# EAGLE design electric fencehigh voltage generator (EAGLE 6.4)
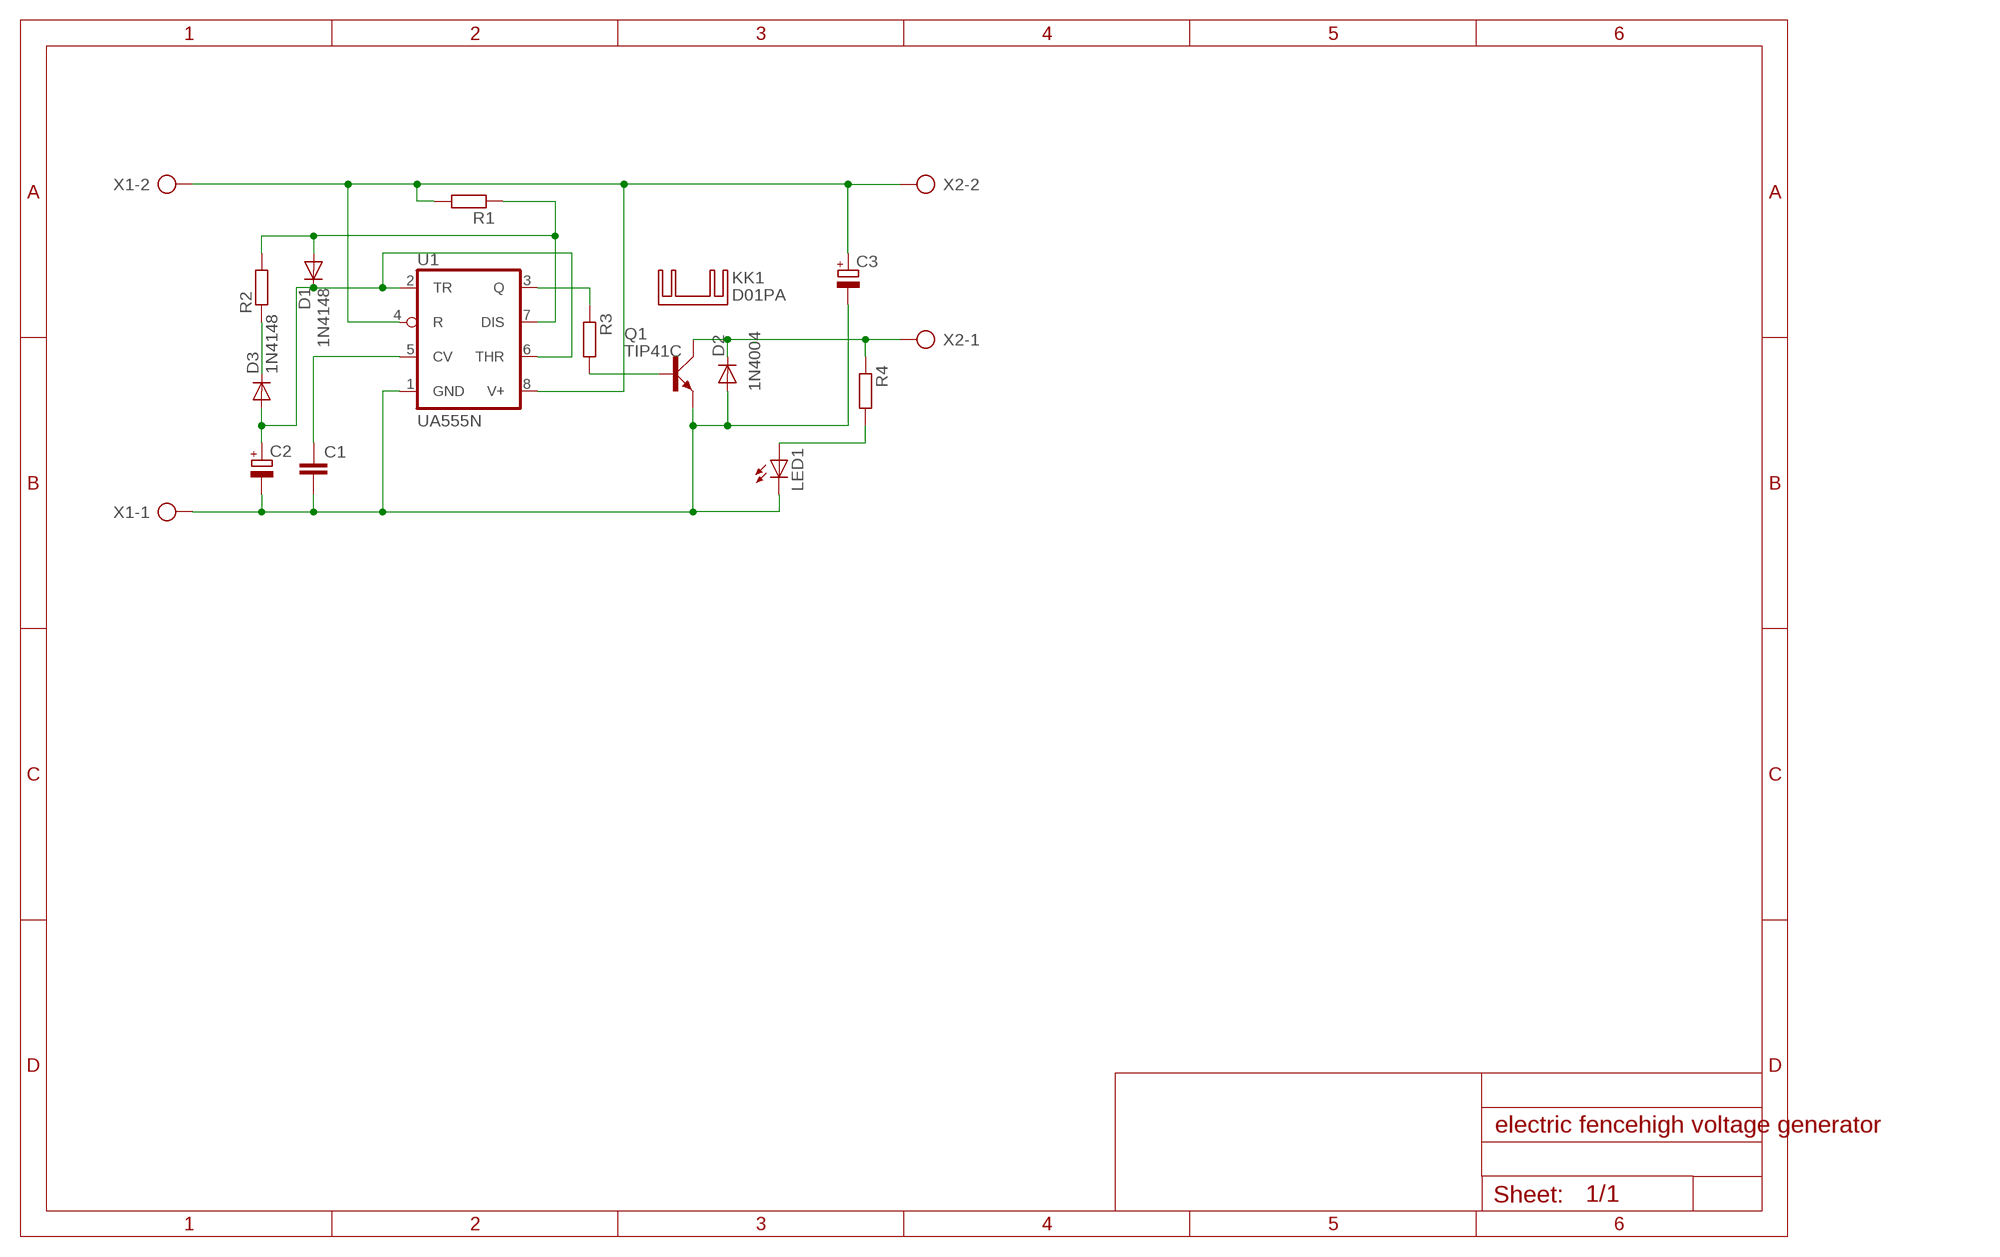
[diagram p0: schematic, sheet 1]

## Parts
C1  C-EU050-030X075  [C050-030X075]
C2  CPOL-EUE2.5-5  [E2,5-5]
C3  CPOL-EUE2.5-5  [E2,5-5]
D1  1N4148  1N4148DO35-7  [DO35-7]
D2  1N4004  [DO41-10]
D3  1N4148  1N4148DO35-7  [DO35-7]
KK1  D01PA  [D01PA]
LED1  LED5MM  [LED5MM]
Q1  TIP41C  [TO220AV]
R1  R-EU_0207/10  [0207/10]
R2  R-EU_0207/10  [0207/10]
R3  R-EU_0207/15  [0207/15]
R4  R-EU_0207/10  [0207/10]
U1  UA555N  [DIL08]
X1  AK300/2  [AK300/2]
X2  AK300/2  [AK300/2]

## Nets
N$1: C3.+ R1.2 U1.4(R) U1.8(V+) X1.2 X2.2
N$2: R3.1 U1.3(Q)
N$3: Q1.B R3.2
N$4: D2.C Q1.C R4.1 X2.1
N$5: C2.+ D1.C D3.A U1.2(TR) U1.6(THR)
N$6: D1.A R1.1 R2.2 U1.7(DIS)
N$7: D3.C R2.1
N$8: LED1.A R4.2
N$9: C1.2 C2.- C3.- D2.A LED1.K(C) Q1.E U1.1(GND) X1.1
N$10: C1.1 U1.5(CV)

## Library data of the parts
C1 = rcl:C-EU: CAPACITOR, European symbol
C2 C3 = rcl:CPOL-EU: POLARIZED CAPACITOR, European symbol
D1 D3 = diode:1N4148: DIODE high speed (Philips)
D2 = diode:1N4004: DIODE general purpose rectifier, 1 A
KK1 = heatsink:D01PA: HEATSINK distributor Schukat
LED1 = led:LED: LED OSRAM: - CHIPLED LG R971, LG N971, LY N971, LG Q971, LY Q971, LO R971, LY R971 LH N974, LH R974 LS Q976, LO Q976, LY Q976 LO Q996 - Hyper CHIPLED LW Q18S LB Q993, LB Q99A, LB R99A - SideLED LS A670, LO A670, LY A670, LG A670, LP A670 LB A673, LV A673, LT A673, LW A673 LH A674 LY A675 LS A676, LA A676, LO A676, LY A676, LW A676 LS A679, LY A679, LG A679 - Hyper Micro SIDELED® LS Y876, LA Y876, LO Y876, LY Y876 LT Y87S - SmartLED LW L88C, LW L88S LB L89C, LB L89S, LG L890 LS L89K, LO L89K, LY L89K LS L896, LA L896, LO L896, LY L896 - TOPLED LS T670, LO T670, LY T670, LG T670, LP T670 LSG T670, LSP T670, LSY T670, LOP T670, LYG T670 LG T671, LOG T671, LSG T671 LB T673, LV T673, LT T673, LW T673 LH T674 LS T676, LA T676, LO T676, LY T676, LB T676, LH T676, LSB T676, LW T676 LB T67C, LV T67C, LT T67C, LS T67K, LO T67K, LY T67K, LW E67C LS E67B, LA E67B, LO E67B, LY E67B, LB E67C, LV E67C, LT E67C LW T67C LS T679, LY T679, LG T679 LS T770, LO T770, LY T770, LG T770, LP T770 LB T773, LV T773, LT T773, LW T773 LH T774 LS E675, LA E675, LY E675, LS T675 LS T776, LA T776, LO T776, LY T776, LB T776 LHGB T686 LT T68C, LB T68C - Hyper Mini TOPLED® LB M676 - Mini TOPLED Santana® LG M470 LS M47K, LO M47K, LY M47K Source: http://www.osram.convergy.de LUXEON: - LUMILED® LXK2-PW12-R00, LXK2-PW12-S00, LXK2-PW14-U00, LXK2-PW14-V00 LXK2-PM12-R00, LXK2-PM12-S00, LXK2-PM14-U00 LXK2-PE12-Q00, LXK2-PE12-R00, LXK2-PE12-S00, LXK2-PE14-T00, LXK2-PE14-U00 LXK2-PB12-K00, LXK2-PB12-L00, LXK2-PB12-M00, LXK2-PB14-N00, LXK2-PB14-P00, LXK2-PB14-Q00 LXK2-PR12-L00, LXK2-PR12-M00, LXK2-PR14-Q00, LXK2-PR14-R00 LXK2-PD12-Q00, LXK2-PD12-R00, LXK2-PD12-S00 LXK2-PH12-R00, LXK2-PH12-S00 LXK2-PL12-P00, LXK2-PL12-Q00, LXK2-PL12-R00 Source: www.luxeon.com KINGBRIGHT: KA-3528ASYC Source: www.kingbright.com
Q1 = transistor-power:TIP41C: NPN TRANSISTOR
R1-R4 = rcl:R-EU_: RESISTOR, European symbol
U1 = linear:*555: TIMER
X1 X2 = con-ptr500:AK300/2: CONNECTOR; OC_FARNELL: unknown; OC_NEWARK: unknown

## Board
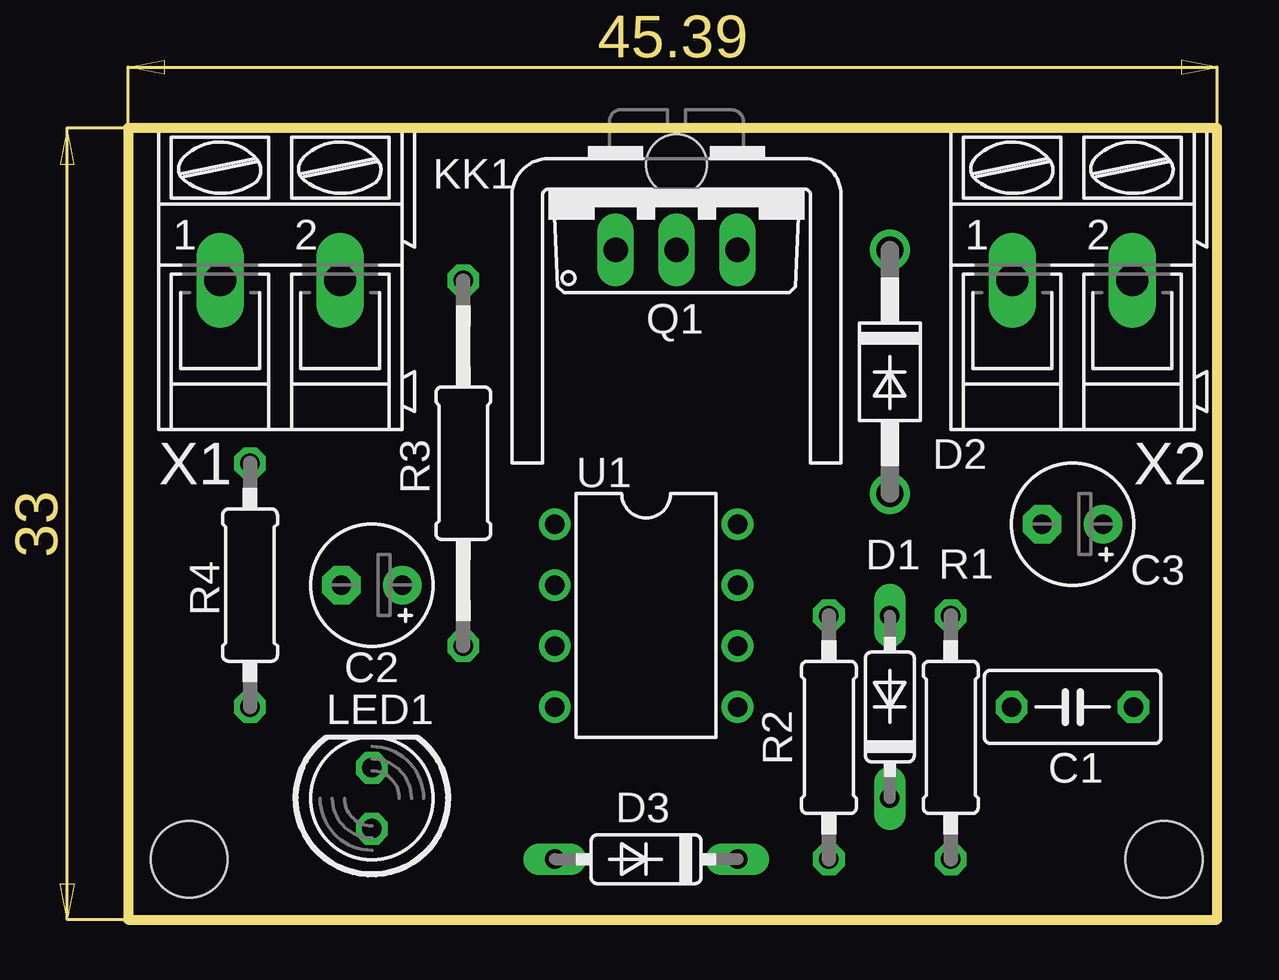
[diagram p1: board, top side]
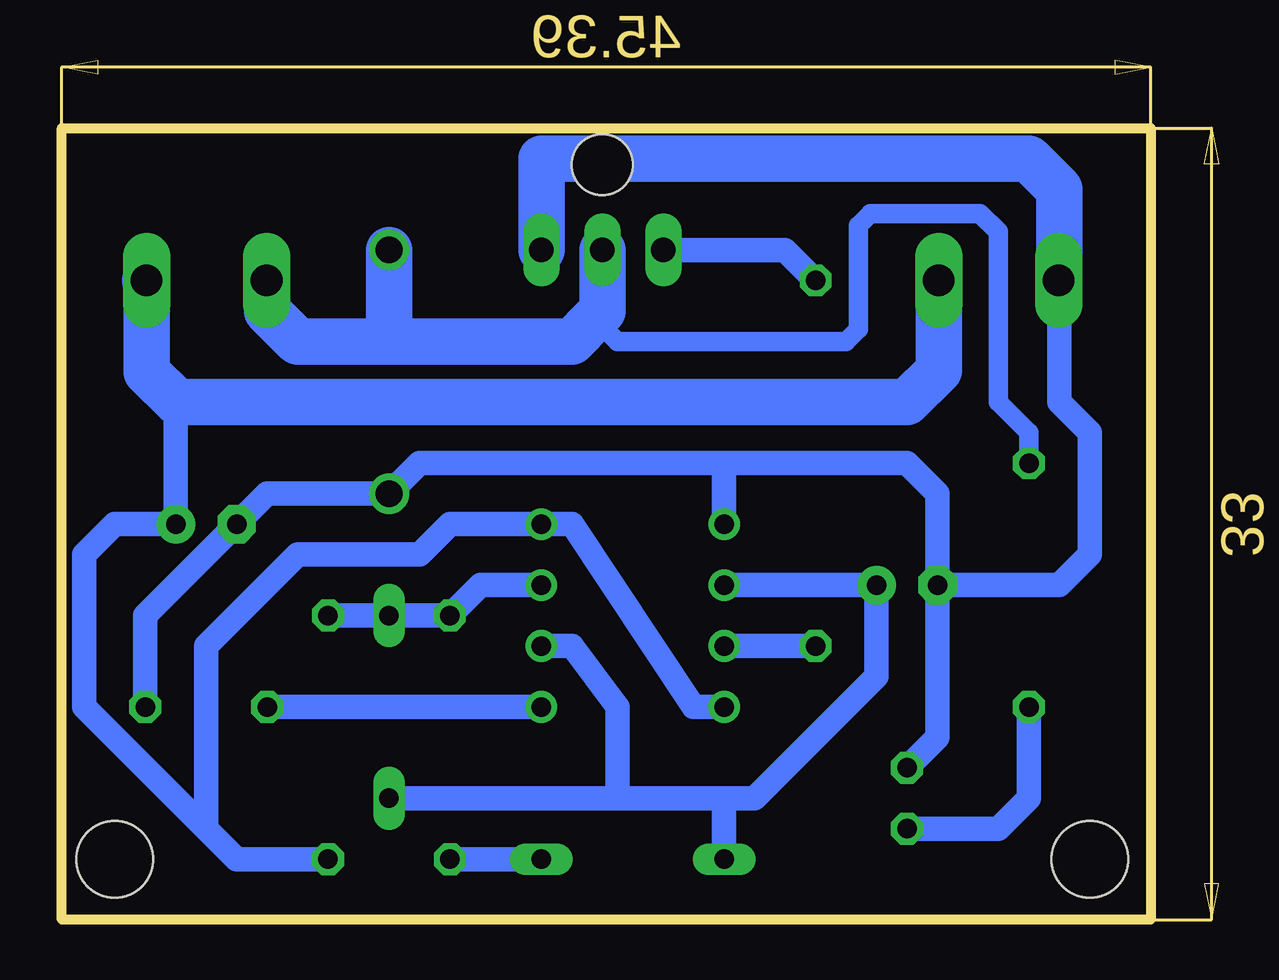
[diagram p2: board, bottom side, seen from below]

Size 45.39 x 33 mm. Coordinates in mm from the lower left corner, seen from the top.
Outline: 0,33 0,0 45.39,0 45.39,33 0,33
Copper layers (1*16): Top 0.035mm / dielectric 1.5mm / Bottom 0.035mm
Design rules "default": minimum track width 10mil, minimum drill 24mil, track to track 8mil, track to pad 8mil, pad to pad 8mil, via to via 8mil, smd to smd 8mil, copper to edge 40mil, drill to drill 8mil, minimum pad ring 10mil, minimum via ring 8mil, stop-mask expansion 4mil, vias tented up to drill 0mil, thermal gap 10mil
Holes 3.2 mm at 2.54,2.52 43.18,2.52

### Footprints (pad centres in the part's own frame; a part is rotated, then mirrored left to right if it is on the bottom)
C050-030X075 = drill 0.813 octagon: 1 -2.54,0; 2 2.54,0
E2,5-5 = drill 0.813 pad 1.6: + -1.27,0 | drill 0.813 pad 1.6 octagon: - 1.27,0
DO35-7 = drill 0.813 long: A 3.81,0; C -3.81,0
DO41-10 = drill 1.118: A 5.08,0; C -5.08,0
D01PA = hole 2.54: 0,-1.016
LED5MM = drill 0.813 octagon: A -1.27,0; K 1.27,0
TO220AV = drill 1.016 long: B -2.54,-2.54; C 0,-2.54; E 2.54,-2.54
0207/10 = drill 0.813 octagon: 1 -5.08,0; 2 5.08,0
0207/15 = drill 0.813 octagon: 1 -7.62,0; 2 7.62,0
DIL08 = drill 0.813 pad 1.27: 1 -3.81,-3.81; 2 -1.27,-3.81; 3 1.27,-3.81; 4 3.81,-3.81; 5 3.81,3.81; 6 1.27,3.81; 7 -1.27,3.81; 8 -3.81,3.81
AK300/2 = drill 1.321 long: 1 -2.515,0; 2 2.489,0

### Placement (x,y rotation side)
C1  39.37,8.87 0 top
C2  10.16,13.95 180 top
C3  39.37,16.49 180 top
D1  31.75,8.87 90 top
D2  31.75,22.84 270 top
D3  21.59,2.52 180 top
KK1  22.86,30.46 180 top
LED1  10.16,5.06 90 top
Q1  22.86,30.46 0 top
R1  34.29,7.6 270 top
R2  29.21,7.6 90 top
R3  13.97,19.03 90 top
R4  5.08,13.95 270 top
U1  21.59,12.68 270 top
X1  6.35,26.65 0 top
X2  39.37,26.65 0 top

### Tracks (layer width: path | path; a pad name or v marks a point on that pad's centre or on a via)
N$1
  Bottom 1.016: 40.59,21.57 40.64,21.52 C3.+ 43.18,16.49 44.45,15.22 44.45,8.87 39.37,3.79 | 39.37,3.79 38.1,2.52 R1.2 | 39.37,3.79 39.37,11.41 35.56,15.22 30.48,15.22 29.21,16.49 U1.8 24.13,16.49 19.05,8.87 U1.4
  Bottom 1.93: X1.2 8.84,22.89 10.16,21.57 40.59,21.57 41.86,22.84 41.86,26.6 41.91,26.65 X2.2
N$2
  Bottom 1.016: R3.1 U1.3
N$3
  Bottom 1.016: Q1.B 15.24,27.92 R3.2
N$4
  Bottom 0.813: R4.1 5.08,20.3 6.35,21.57 6.35,28.68 7.11,29.44 11.68,29.44 12.19,28.94 12.19,24.62 12.7,24.11 22.23,24.11 23.18,25.06
  Bottom 1.93: Q1.C 22.86,25.38 23.18,25.06 24.13,24.11 31.75,24.11 | 31.75,24.11 35.56,24.11 36.83,25.38 36.83,26.62 X2.1 | D2.C 31.75,24.11
N$5
  Bottom 1.016: D1.C 22.23,5.06 | U1.6 24.13,11.41 22.23,8.87 22.23,5.06 | D3.A 17.78,5.06 | 22.23,5.06 17.78,5.06 | U1.2 C2.+ 11.43,10.14 16.51,5.06 17.78,5.06
N$6
  Bottom 1.016: R1.1 D1.A R2.2 27.94,13.95 U1.7
N$7
  Bottom 1.016: D3.C R2.1
N$8
  Bottom 1.016: R4.2 5.08,5.06 6.35,3.79 LED1.A
N$9
  Bottom 0.61: 24.19,18.97 24.13,19.03
  Bottom 1.016: 17.78,19.03 24.13,19.03 30.48,19.03 D2.A 36.83,17.76 C3.- 41.91,12.68 C1.2 | U1.1 17.78,19.03 | 17.78,19.03 10.16,19.03 8.89,17.76 C2.- | C2.- 8.89,7.6 LED1.K | 3.81,30.46 3.81,21.57 2.54,20.3 2.54,15.22 3.81,13.95 C2.-
  Bottom 1.93: X1.1 3.81,26.68 3.81,30.46 5.08,31.73 25.4,31.73 Q1.E
N$10
  Bottom 1.016: U1.5 C1.1